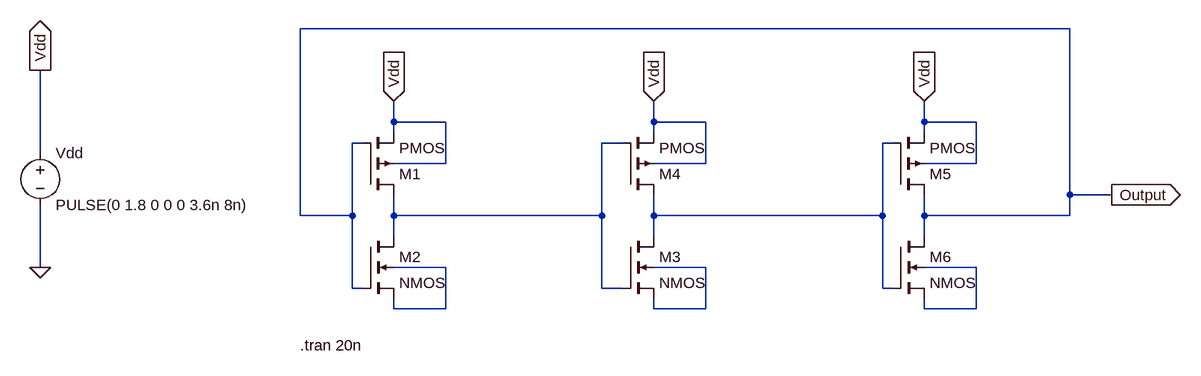
[diagram p0: schematic 3_ring_osc.asc]
3_ring_osc.asc, the LTspice schematic file:
Version 4
SHEET 1 1800 804
WIRE 1104 -96 -80 -96
WIRE 64 48 64 16
WIRE 144 48 64 48
WIRE 464 48 464 16
WIRE 544 48 464 48
WIRE 880 48 880 16
WIRE 960 48 880 48
WIRE 64 64 64 48
WIRE 464 64 464 48
WIRE 880 64 880 48
WIRE 16 80 0 80
WIRE 416 80 384 80
WIRE 832 80 816 80
WIRE -480 96 -480 -32
WIRE 144 112 144 48
WIRE 144 112 64 112
WIRE 544 112 544 48
WIRE 544 112 464 112
WIRE 960 112 960 48
WIRE 960 112 880 112
WIRE 1104 160 1104 -96
WIRE 1168 160 1104 160
WIRE -80 192 -80 -96
WIRE 0 192 0 80
WIRE 0 192 -80 192
WIRE 64 192 64 160
WIRE 384 192 384 80
WIRE 384 192 64 192
WIRE 464 192 464 160
WIRE 816 192 816 80
WIRE 816 192 464 192
WIRE 880 192 880 160
WIRE 1104 192 1104 160
WIRE 1104 192 880 192
WIRE 64 224 64 192
WIRE 464 224 464 192
WIRE 880 224 880 192
WIRE -480 272 -480 176
WIRE 144 272 64 272
WIRE 544 272 464 272
WIRE 960 272 880 272
WIRE 0 304 0 192
WIRE 16 304 0 304
WIRE 384 304 384 192
WIRE 416 304 384 304
WIRE 816 304 816 192
WIRE 832 304 816 304
WIRE 64 336 64 320
WIRE 144 336 144 272
WIRE 144 336 64 336
WIRE 464 336 464 320
WIRE 544 336 544 272
WIRE 544 336 464 336
WIRE 880 336 880 320
WIRE 960 336 960 272
WIRE 960 336 880 336
FLAG 64 16 Vdd
IOPIN 64 16 In
FLAG 464 16 Vdd
IOPIN 464 16 In
FLAG 880 16 Vdd
IOPIN 880 16 In
FLAG 1168 160 Output
IOPIN 1168 160 Out
FLAG -480 272 0
FLAG -480 -32 Vdd
IOPIN -480 -32 Out
SYMBOL pmos4 16 160 M180
SYMATTR InstName M1
SYMATTR Value2 l=180n w=720n
SYMBOL nmos4 16 224 R0
SYMATTR InstName M2
SYMATTR Value2 l=180n w=360n
SYMBOL nmos4 416 224 R0
SYMATTR InstName M3
SYMATTR Value2 l=180n w=360n
SYMBOL pmos4 416 160 M180
SYMATTR InstName M4
SYMATTR Value2 l=180n w=720n
SYMBOL pmos4 832 160 M180
SYMATTR InstName M5
SYMATTR Value2 l=180n w=720n
SYMBOL nmos4 832 224 R0
SYMATTR InstName M6
SYMATTR Value2 l=180n w=360n
SYMBOL voltage -480 80 R0
WINDOW 123 0 0 Left 0
WINDOW 39 0 0 Left 0
SYMATTR InstName Vdd
SYMATTR Value PULSE(0 1.8 0 0 0 3.6n 8n)
TEXT -80 392 Left 2 !.tran 20n

The netlist it stands for:
* 3_ring_osc.asc
M1 N001 Output Vdd Vdd PMOS l=180n w=720n
M2 N001 Output N003 N003 NMOS l=180n w=360n
M3 N002 N001 N004 N004 NMOS l=180n w=360n
M4 N002 N001 Vdd Vdd PMOS l=180n w=720n
M5 Output N002 Vdd Vdd PMOS l=180n w=720n
M6 Output N002 N005 N005 NMOS l=180n w=360n
Vdd Vdd 0 PULSE(0 1.8 0 0 0 3.6n 8n)
.model NMOS NMOS
.model PMOS PMOS
.lib standard.mos
.tran 20n
.backanno
.end